# Altium schematic sheet 28Pins_Project_V1I1.SchDoc (part 3 of 3)
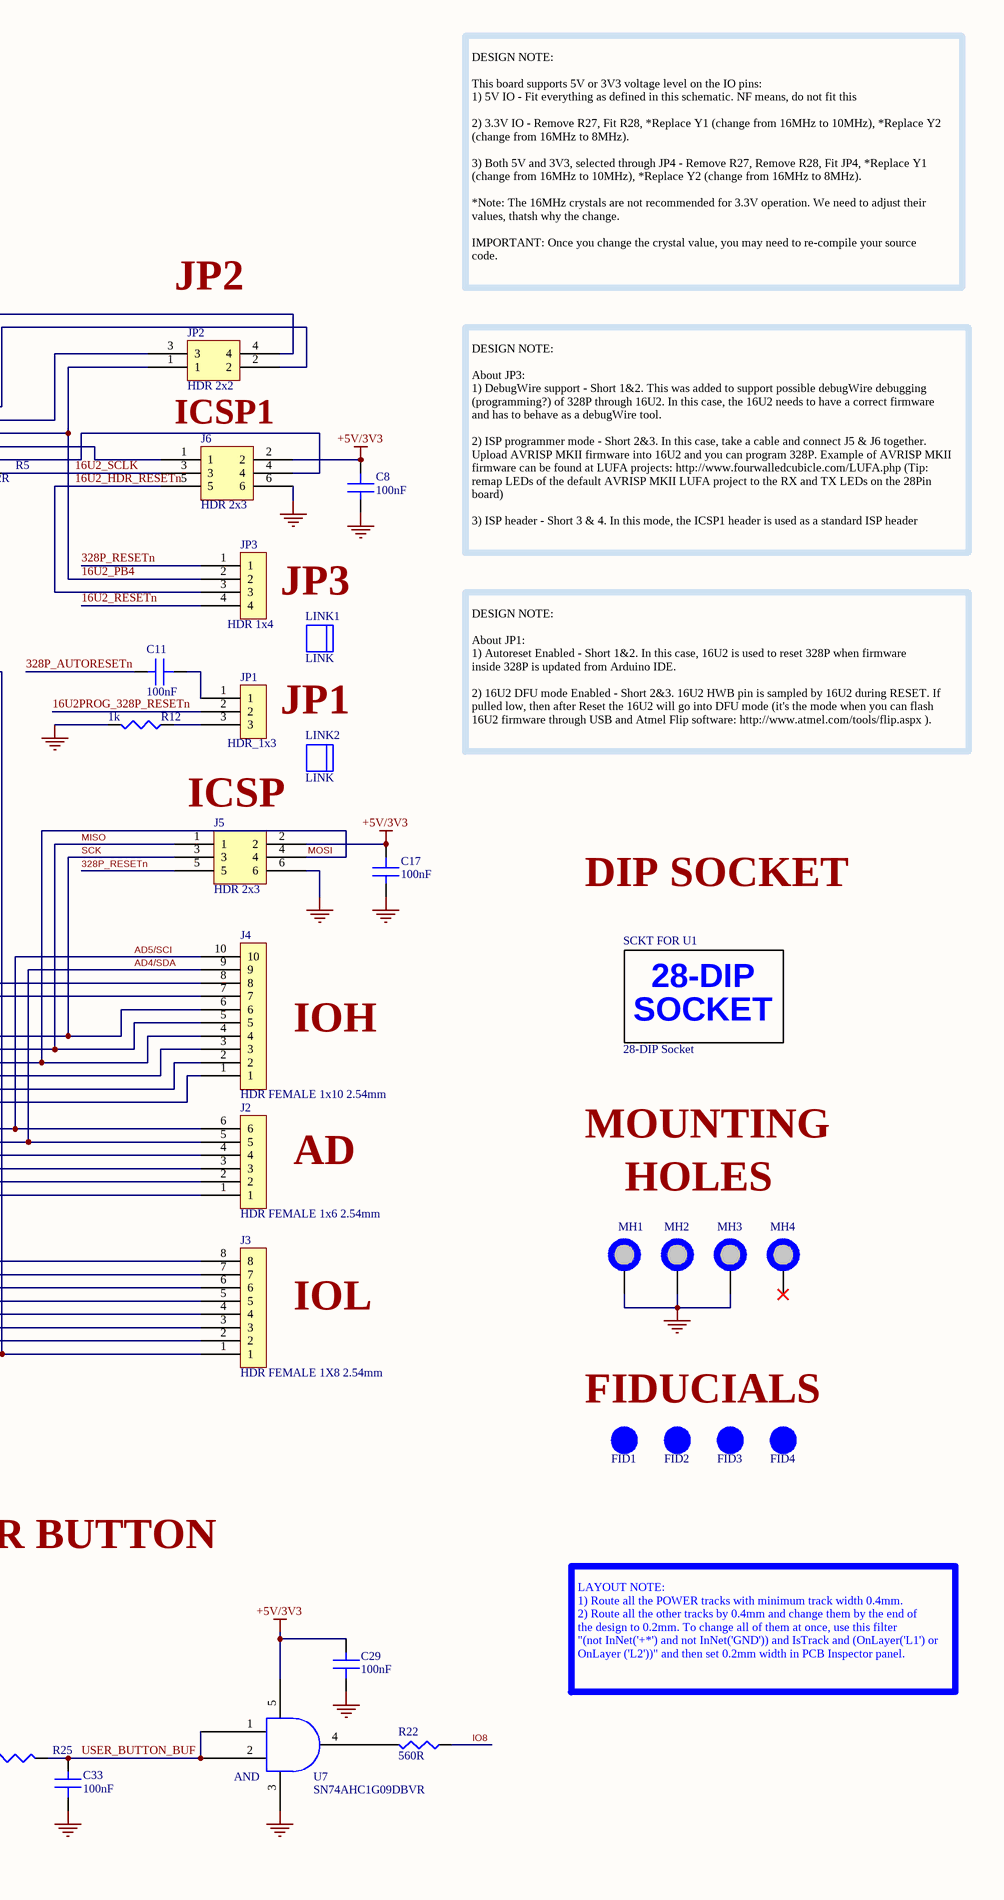
[diagram p3: 28Pins_Project_V1I1.SchDoc, right]

## Library data of the parts (continued)
U4-U7 = AND Gate: IC GATE AND 1CH 2-INP SOT-23-5; Manufacturer: Texas Instruments; Output Voltage: 5.5V; Number of Inputs: 2; Propagation Delay: 7.5ns; Min Supply Voltage: 2V; Output Current: 25mA; Number of Outputs: 1; Quiescent Current: 1uA; Low Level Output Current: 8mA; Supplier 1: Mouser; Manufacturer Part Number: SN74AHC1G09DBVR; RoHS: Yes; Category: Logic Gates; Pricing 1: 1=0,48000, 10=0,35600, 50=0,35600, 100=0,17900, 1000=0,10300, 10000=0,08000 (USD); Mount: Surface Mount; Case/Package: SOT-23; Number of Pins: 5; Contact Plating: Tin,Matte; Min Operating Temperature: -55°C; Max Operating Temperature: 125°C; Package Quantity: 3000; Packaging: Tape and Reel; Max Supply Voltage: 5.5V; Logic Function: AND GATE; Number of Circuits: 1; Number of Gates: 1; Number of Elements: 1; Number of Bits: 1; Series: 74AHC; Technology: CMOS; Radiation Hardening: No; REACH SVHC: No SVHC; Lead Free: Lead Free; RoHS Compliant: Yes; ComponentLink1URL: https://datasheet.ciiva.com/1864/sn74ahc1g09-1864411.pdf?src-supplier=Digi-Key; ComponentLink1Description: https://datasheet.ciiva.com/1864/sn74ahc1g09-1864411.pdf?src-supplier=Digi-Key; ComponentLink2URL: https://datasheet.ciiva.com/1864/sn74ahc1g09-1864410.pdf?src-supplier=Digi-Key; ComponentLink2Description: https://datasheet.ciiva.com/1864/sn74ahc1g09-1864410.pdf?src-supplier=Digi-Key; ComponentLink3URL: https://datasheet.ciiva.com/1864/sn74ahc1g09-1864412.pdf?src-supplier=Digi-Key; ComponentLink3Description: https://datasheet.ciiva.com/1864/sn74ahc1g09-1864412.pdf?src-supplier=Digi-Key; Supplier Part Number 1: 595-SN74AHC1G09DBVR
Y1 Y2 = ABM7-16.000MHZ-D2Y-T: Crystal 16MHz ±20ppm (Tol) ±30ppm (Stability) 18pF FUND 50Ohm 2-Pin Mini-CSMD T/R; Manufacturer: Abracon; ESR (Equivalent Series Resistance): 50R; Supplier 1: Arrow Electronics; Manufacturer Part Number: ABM7-16.000MHZ-D2Y-T; RoHS: Yes; Category: Crystals; Stock 1: 685; Pricing 1: 1=0,74460, 10=0,73720, 25=0,72980, 50=0,69970, 100=0,62360, 250=0,61920, 500=0,59130 (USD); Mount: Surface Mount; Case/Package: CSMD; Number of Pins: 2; Min Operating Temperature: -40°C; Max Operating Temperature: 85°C; Frequency Tolerance: 20ppm; Load Capacitance: 18pF; Frequency: 16MHz; Frequency Stability: 30ppm; Packaging: Tape and Reel; Package Quantity: 1000; Tolerance: 20ppm; Termination: SMD/SMT; Resistor Type: Ceramic; Series: ABM7; Operating Frequency: 16 MHz; Length: 6mm; Width: 3.3mm; Height: 0.055inch; Depth: 3.5mm; Radiation Hardening: No; REACH SVHC: Unknown; Lead Free: Lead Free; ComponentLink1URL: https://datasheet.ciiva.com/15116/getdatasheetpartid-721624-15116835.pdf?src-supplier=Verical; ComponentLink1Description: https://datasheet.ciiva.com/15116/getdatasheetpartid-721624-15116835.pdf?src-supplier=Verical; ComponentLink2URL: https://datasheet.ciiva.com/5788/abm7-5788054.pdf?src-supplier=Farnell; ComponentLink2Description: https://datasheet.ciiva.com/5788/abm7-5788054.pdf?src-supplier=Farnell; ComponentLink3URL: https://datasheet.ciiva.com/7998/947971-7998600.pdf?src-supplier=Element14; ComponentLink3Description: https://datasheet.ciiva.com/7998/947971-7998600.pdf?src-supplier=Element14; ComponentLink4URL: https://datasheet.ciiva.com/22658/947971-22658293.pdf?src-supplier=Element14; ComponentLink4Description: https://datasheet.ciiva.com/22658/947971-22658293.pdf?src-supplier=Element14; ComponentLink5URL: https://datasheet.ciiva.com/46385/947971-46385243.pdf?src-supplier=Element14; ComponentLink5Description: https://datasheet.ciiva.com/46385/947971-46385243.pdf?src-supplier=Element14; ComponentLink6URL: https://datasheet.ciiva.com/18649/abm7-18649866.pdf?src-supplier=Digi-Key; ComponentLink6Description: https://datasheet.ciiva.com/18649/abm7-18649866.pdf?src-supplier=Digi-Key; ComponentLink7URL: https://datasheet.ciiva.com/18649/abm7-18649865.pdf?src-supplier=Digi-Key; ComponentLink7Description: https://datasheet.ciiva.com/18649/abm7-18649865.pdf?src-supplier=Digi-Key; ComponentLink8URL: https://datasheet.ciiva.com/18649/abm7-18649867.pdf?src-supplier=Digi-Key; ComponentLink8Description: https://datasheet.ciiva.com/18649/abm7-18649867.pdf?src-supplier=Digi-Key; ComponentLink9URL: https://datasheet.ciiva.com/16383/abm7-16383174.pdf?src-supplier=Future+Electronics; ComponentLink9Description: https://datasheet.ciiva.com/16383/abm7-16383174.pdf?src-supplier=Future+Electronics; ComponentLink10URL: https://datasheet.ciiva.com/26941/getdatasheetpartid-719818-26941724.pdf?src-supplier=Verical; ComponentLink10Description: https://datasheet.ciiva.com/26941/getdatasheetpartid-719818-26941724.pdf?src-supplier=Verical; Supplier Part Number 1: ABM7-16.000MHZ-D2Y-T
Z1 Z2 = CG0603MLC-05E: VARISTOR 0603; Manufacturer: Bourns; Capacitance: 0.5pF; Voltage Rating (DC): 5V; Number of Channels: 1; Clamping Voltage: 20V; Current Rating: 50nA; Voltage Rating (AC): 8V; Turn-On Delay Time: 1ns; Element Configuration: Single; Supplier 1: Arrow Electronics; Manufacturer Part Number: CG0603MLC-05E; RoHS: Yes; Category: Varistors; Stock 1: 10000; Pricing 1: 5000=0,11500, 10000=0,10170, 25000=0,07640, 50000=0,07160, 125000=0,06660 (USD); Case/Package: 0603; Number of Pins: 2; Case Code (Imperial): 0603; Case Code (Metric): 1608; Contact Plating: Tin; Min Operating Temperature: -40°C; Max Operating Temperature: 85°C; Operating Supply Voltage: 5V; Package Quantity: 1; Packaging: Tape and Reel; Termination: SMD/SMT; Voltage: 5V; Number of Circuits: 1; Max Voltage Rating (DC): 5V; Working Voltage: 5V; Leakage Current: 50nA; Series: MLC; Length: 1.6mm; Width: 0.8mm; Depth: 0.8mm; Thickness: 0.8mm; Radiation Hardening: No; REACH SVHC: No SVHC; RoHS Compliant: Yes; ComponentLink1URL: https://datasheet.ciiva.com/27747/1163231-27747629.pdf?src-supplier=Jameco; ComponentLink1Description: https://datasheet.ciiva.com/27747/1163231-27747629.pdf?src-supplier=Jameco; ComponentLink2URL: https://datasheet.ciiva.com/30070/mlc-30070503.pdf?src-supplier=Onlinecomponents.com; ComponentLink2Description: https://datasheet.ciiva.com/30070/mlc-30070503.pdf?src-supplier=Onlinecomponents.com; ComponentLink3URL: https://datasheet.ciiva.com/6991/mlc-6991832.pdf?src-supplier=Digi-Key; ComponentLink3Description: https://datasheet.ciiva.com/6991/mlc-6991832.pdf?src-supplier=Digi-Key; ComponentLink4URL: https://datasheet.ciiva.com/6991/mlc-6991834.pdf?src-supplier=Digi-Key; ComponentLink4Description: https://datasheet.ciiva.com/6991/mlc-6991834.pdf?src-supplier=Digi-Key; ComponentLink5URL: https://datasheet.ciiva.com/6991/mlc-6991836.pdf?src-supplier=Digi-Key; ComponentLink5Description: https://datasheet.ciiva.com/6991/mlc-6991836.pdf?src-supplier=Digi-Key; ComponentLink6URL: https://datasheet.ciiva.com/1278/1785244-1278701.pdf?src-supplier=Element14; ComponentLink6Description: https://datasheet.ciiva.com/1278/1785244-1278701.pdf?src-supplier=Element14; ComponentLink7URL: https://datasheet.ciiva.com/22696/1785244-22696318.pdf?src-supplier=Element14; ComponentLink7Description: https://datasheet.ciiva.com/22696/1785244-22696318.pdf?src-supplier=Element14; ComponentLink8URL: https://datasheet.ciiva.com/8084/mlc-8084047.pdf?src-supplier=Avnet; ComponentLink8Description: https://datasheet.ciiva.com/8084/mlc-8084047.pdf?src-supplier=Avnet; Supplier Part Number 1: CG0603MLC-05E